# Altium schematic sheet Sheet1.SchDoc
size A3; SheetNumber: 1; SheetTotal: 1
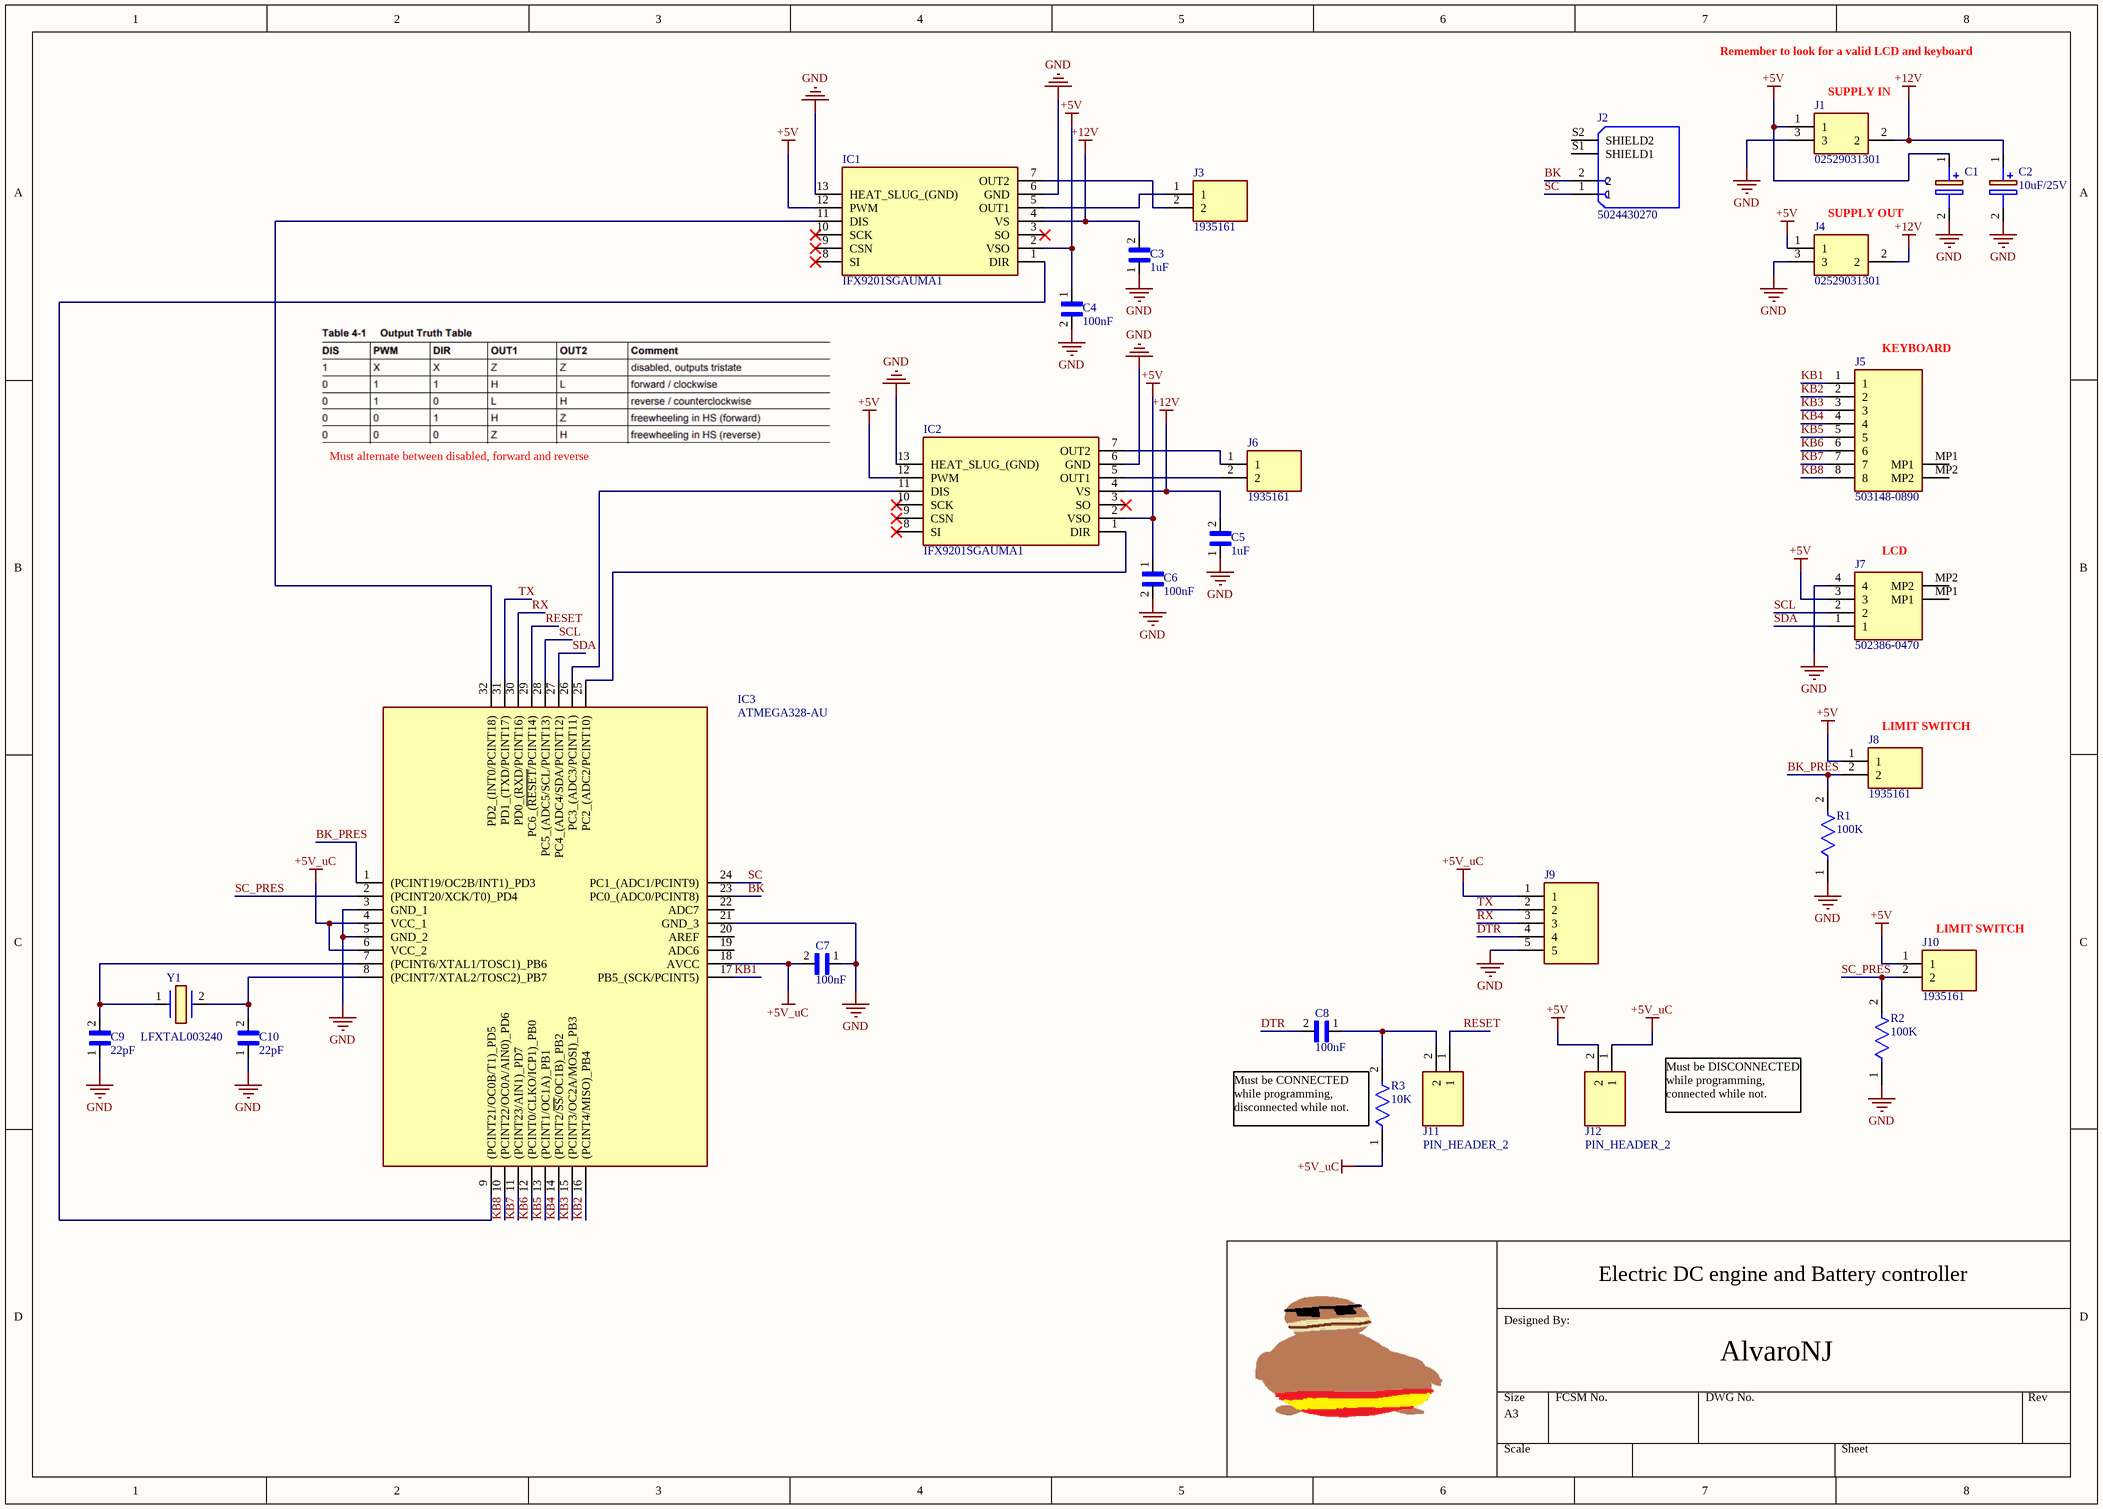
[diagram p0: Sheet1.SchDoc]

## Parts
C1  EEE-1CA100SR  [EEE1AA220WR]  (value not drawn)
C2  10uF/25V  [CAPPRD200W52D500H1250]
C3  1uF  [0603C]
C4  100nF  [0603C]
C5  1uF  [0603C]
C6  100nF  [0603C]
C7  100nF  [0603C]
C8  100nF  [0603C]
C9  22pF  [0603C]
C10  22pF  [0603C]
IC1  IFX9201SGAUMA1  [PG-DSO-12-17]
IC2  IFX9201SGAUMA1  [PG-DSO-12-17]
IC3  ATMEGA328-AU  [QFP80P900X900X120-32N]
J1  02529031301  [02529031301]
J2  5024430270  [MOLEX_5024430270]
J3  1935161  [1935161]
J4  02529031301  [02529031301]
J5  503148-0890  [5031480890]
J6  1935161  [1935161]
J7  502386-0470  [5023860470]
J8  1935161  [1935161]
J9  MOLEX,_C-GRID_III,_90120,_8_WAY,_1_ROW,_STRAIGHT_PIN_HEADER  [HDRV8W65P0X254_1X8_2010X249X945P - duplicate]  (value not drawn)
J10  1935161  [1935161]
J11  PIN_HEADER_2  [PINHEADER2]
J12  PIN_HEADER_2  [PINHEADER2]
R1  100K  [0603R]
R2  100K  [0603R]
R3  10K  [0603R]
Y1  LFXTAL003240  [IQD-HC-49-4H]

## Nets
+5V: C1.1(+) C4.1 C6.1 IC1.2(VSO) IC1.12(PWM) IC2.2(VSO) IC2.12(PWM) J1.1 J4.1 J7.3 J8.1 J10.1 J12.2
+5V_uC: C7.2 IC3.4(VCC_1) IC3.6(VCC_2) IC3.18(AVCC) J9.1 J12.1 R3.1
+12V: C2.1(+) C3.2 C5.2 IC1.4(VS) IC2.4(VS) J1.2 J4.2
GND: C1.2(-) C2.2(-) C3.1 C4.2 C5.1 C6.2 C7.1 C9.1 C10.1 IC1.6(GND) IC1.13(HEAT_SLUG_(GND)) IC2.6(GND) IC2.13(HEAT_SLUG_(GND)) IC3.3(GND_1) IC3.5(GND_2) IC3.21(GND_3) J1.3 J4.3 J7.4 J9.5 R1.1 R2.1
BK: IC3.23(PC0_(ADC0/PCINT8)) J2.2
BK_PRES: IC3.1((PCINT19/OC2B/INT1)_PD3) J8.2 R1.2
DTR: C8.2 J9.4
KB1: IC3.17(PB5_(SCK/PCINT5)) J5.1
KB2: IC3.16((PCINT4/MISO)_PB4) J5.2
KB3: IC3.15((PCINT3/OC2A/MOSI)_PB3) J5.3
KB4: IC3.14((PCINT2/~{SS}/OC1B)_PB2) J5.4
KB5: IC3.13((PCINT1/OC1A)_PB1) J5.5
KB6: IC3.12((PCINT0/CLKO/ICP1)_PB0) J5.6
KB7: IC3.11((PCINT23/AIN1)_PD7) J5.7
KB8: IC3.10((PCINT22/OC0A/AIN0)_PD6) J5.8
RESET: IC3.29(PC6_(~{RESET}/PCINT14)) J11.1
RX: IC3.30(PD0_(RXD/PCINT16)) J9.3
SC: IC3.24(PC1_(ADC1/PCINT9)) J2.1
SC_PRES: IC3.2((PCINT20/XCK/T0)_PD4) J10.2 R2.2
SCL: IC3.28(PC5_(ADC5/SCL/PCINT13)) J7.2
SDA: IC3.27(PC4_(ADC4/SDA/PCINT12)) J7.1
TX: IC3.31(PD1_(TXD/PCINT17)) J9.2
NetC8_1: C8.1 J11.2 R3.2
NetC9_2: C9.2 IC3.7((PCINT6/XTAL1/TOSC1)_PB6) Y1.1
NetC10_2: C10.2 IC3.8((PCINT7/XTAL2/TOSC2)_PB7) Y1.2
NetIC1_1: IC1.1(DIR) IC3.9((PCINT21/OC0B/T1)_PD5)
NetIC1_5: IC1.5(OUT1) J3.1
NetIC1_7: IC1.7(OUT2) J3.2
NetIC1_11: IC1.11(DIS) IC3.32(PD2_(INT0/PCINT18))
NetIC2_1: IC2.1(DIR) IC3.25(PC2_(ADC2/PCINT10))
NetIC2_5: IC2.5(OUT1) J6.2
NetIC2_7: IC2.7(OUT2) J6.1
NetIC2_11: IC2.11(DIS) IC3.26(PC3_(ADC3/PCINT11))

Not connected (* = marked no-connect by the designer): IC1 3(SO)* 8(SI)* 9(CSN)* 10(SCK)*; IC2 3(SO)* 8(SI)* 9(CSN)* 10(SCK)*; IC3 19(ADC6) 20(AREF) 22(ADC7); J2 S1(SHIELD1) S2(SHIELD2); J5 MP1 MP2; J7 MP1 MP2

## Notes on the sheet
- Remember to look for a valid LCD and keyboard
- (near J1) SUPPLY IN
- (near J4) SUPPLY OUT
- (near J5) KEYBOARD
- Must alternate between disabled, forward and reverse
- (near J7) LCD
- (near J8) LIMIT SWITCH
- (near J10) LIMIT SWITCH
- (near R3) Must be CONNECTED while programming, disconnected while not.
- Must be DISCONNECTED while programming, connected while not.
- Designed By:
- Electric DC engine and Battery controller
- AlvaroNJ

## Library data of the parts
C1 = EEE-1CA100SR: Capacitor Polarised; Manufacturer_Name: Panasonic; Datasheet Link: http://industrial.panasonic.com/cdbs/www-data/pdf/RDE0000/ABA0000C1145.pdf; Height: 5.5mm; Manufacturer_Part_Number: EEE-1CA100SR; Mouser Part Number: 667-EEE-1CA100SR; Mouser Price/Stock: https://www.mouser.co.uk/ProductDetail/Panasonic/EEE-1CA100SR?qs=ANJC8C65Mw5HUsKv8znGCA%3D%3D; Arrow Part Number: EEE-1CA100SR; Arrow Price/Stock: https://www.arrow.com/en/products/eee-1ca100sr/panasonic?region=europe
C2 = 860010472002: Capacitor Polarised; Manufacturer: Wurth Elektronik; Datasheet Link: https://www.we-online.com/catalog/datasheet/860010472002.pdf; Height: 12.5mm; Manufacturer Part number: 860010472002; Mouser Part Number: 710-860010472002; Mouser Price/Stock: https://www.mouser.co.uk/ProductDetail/Wurth-Elektronik/860010472002?qs=0KOYDY2FL2%2FyXlauDHcLjg%3D%3D
C3 C5 = Ceramic_Capacitor: Cap Ceramic 1uF 25V; Manufacturer: Samsung; Manufacturer Part number: CL10A105KA8NNNC; Value: 1uF
C4 C6 = Ceramic_Capacitor: Cap Ceramic 100nF; Manufacturer: Kyocera; Manufacturer Part number: KGM15BR71E104KT; Value: 100nF
C7 C8 = Ceramic_Capacitor: Cap Ceramic 22pF; Manufacturer: Kyocera; Manufacturer Part number: KGM15BR71E104KT; Value: 100nF
C9 C10 = Ceramic_Capacitor: Cap Ceramic 22pF; Manufacturer: Kyocera; Manufacturer Part number: KGM15ACG1C220KT; Value: 22pF
IC1 IC2 = IFX9201SGAUMA1: Integrated Circuit; Manufacturer_Name: Infineon; Datasheet Link: https://www.infineon.com/dgdl/Infineon-IFX9201SG-DS-v01_01-EN.pdf?fileId=5546d4624cb7f111014d2e8916795dea; Height: 2.6mm; Manufacturer_Part_Number: IFX9201SGAUMA1; Mouser Part Number: 726-IFX9201SGAUMA1; Mouser Price/Stock: https://www.mouser.co.uk/ProductDetail/Infineon-Technologies/IFX9201SGAUMA1?qs=CVaTMblcXggE9XQ1VnAvKA%3D%3D; Arrow Part Number: IFX9201SGAUMA1; Arrow Price/Stock: https://www.arrow.com/en/products/ifx9201sgauma1/infineon-technologies-ag?region=nac
IC3 = ATMEGA328-AU: Integrated Circuit; Manufacturer_Name: Microchip; Datasheet Link: https://ww1.microchip.com/downloads/en/DeviceDoc/ATmega48A-PA-88A-PA-168A-PA-328-P-DS-DS40002061B.pdf; Height: 1.2mm; Manufacturer_Part_Number: ATMEGA328-AU; Mouser Part Number: 556-ATMEGA328-AU; Mouser Price/Stock: https://www.mouser.co.uk/ProductDetail/Microchip-Technology/ATMEGA328-AU?qs=lwdSMh1%2FoYJRHuGBjWz9Pg%3D%3D; Arrow Part Number: ATMEGA328-AU; Arrow Price/Stock: https://www.arrow.com/en/products/atmega328-au/microchip-technology?region=europe
J1 J4 = 02529031301: Connector; Manufacturer_Name: HARTING; Datasheet Link: https://b2b.harting.com/files/download/PRD/PDF_DS/PDF_DS_02529031301_EN.pdf; Height: 11.6mm; Manufacturer_Part_Number: 02529031301; Mouser Part Number: 617-02529031301; Mouser Price/Stock: https://www.mouser.co.uk/ProductDetail/HARTING/02529031301?qs=pUKx8fyJudBResgWdfe%2F7g%3D%3D
J2 = 5024430270: 2.00mm Pitch CLIK-Mate Wire-to-Board PCB Receptacle, Single Row, Vertical, with Cover Tape, 2 Circuits; Package: None; MP: 5024430270; Value: *; Availability: Unavailable; Price: None
J3 J6 J8 J10 = 1935161: Connector; Manufacturer_Name: Phoenix Contact; Datasheet Link: https://datasheet.datasheetarchive.com/originals/distributors/SFDatasheet-2/sf-00057459.pdf; Height: 11.55mm; Manufacturer_Part_Number: 1935161; Mouser Part Number: 651-1935161; Mouser Price/Stock: https://www.mouser.co.uk/ProductDetail/Phoenix-Contact/1935161?qs=W3wJikR1%252BS6eKzfFl8Rbew%3D%3D; Arrow Part Number: 1935161; Arrow Price/Stock: https://www.arrow.com/en/products/1935161/phoenix-contact?region=nac
J5 = 503148-0890: Connector; Manufacturer_Name: Molex; Datasheet Link: https://www.molex.com/pdm_docs/sd/5031480890_sd.pdf; Height: 9.4mm; Manufacturer_Part_Number: 503148-0890; Mouser Part Number: 538-503148-0890; Mouser Price/Stock: https://www.mouser.co.uk/ProductDetail/Molex/503148-0890?qs=c8NFF48pVsD%2Fn287kRXVxw%3D%3D; Arrow Part Number: 503148-0890; Arrow Price/Stock: https://www.arrow.com/en/products/5031480890/molex
J7 = 502386-0470: Connector; Manufacturer_Name: Molex; Datasheet Link: https://www.molex.com/pdm_docs/sd/5023860470_sd.pdf; Height: 5.75mm; Manufacturer_Part_Number: 502386-0470; Mouser Part Number: 538-502386-0470; Mouser Price/Stock: https://www.mouser.co.uk/ProductDetail/Molex/502386-0470?qs=Fn3VdHBzkclcj9HD5XfKig%3D%3D; Arrow Part Number: 502386-0470; Arrow Price/Stock: https://www.arrow.com/en/products/5023860470/molex
J9 = MOLEX,_C-GRID_III,_90120,_8_WAY,_1_ROW,_STRAIGHT_PIN_HEADER: Connector; Datasheet Link: https://www.molex.com/pdm_docs/sd/901200128_sd.pdf; Height: 9.45mm; Manufacturer_Name: Molex; Manufacturer_Part_Number: MOLEX
J11 J12 = PIN_HEADER_2: Connector; Manufacturer_Name: Molex; Datasheet Link: https://www.molex.com/pdm_docs/sd/901200128_sd.pdf; Height: 9.45mm; Manufacturer_Part_Number: MOLEX
R1 R2 = Resistor: Manufacturer: Yageo; Manufacturer Part number: RC0603FR-10100KL; Value: 100K
R3 = Resistor: Manufacturer: Yageo; Manufacturer Part number: RC0603FR-1010KL; Value: 10K
Y1 = LFXTAL003240: Crystal or Oscillator; Manufacturer_Name: IQD; Manufacturer_Part_Number: LFXTAL003240